# Altium schematic sheet bg_sensor.SchDoc
size A3
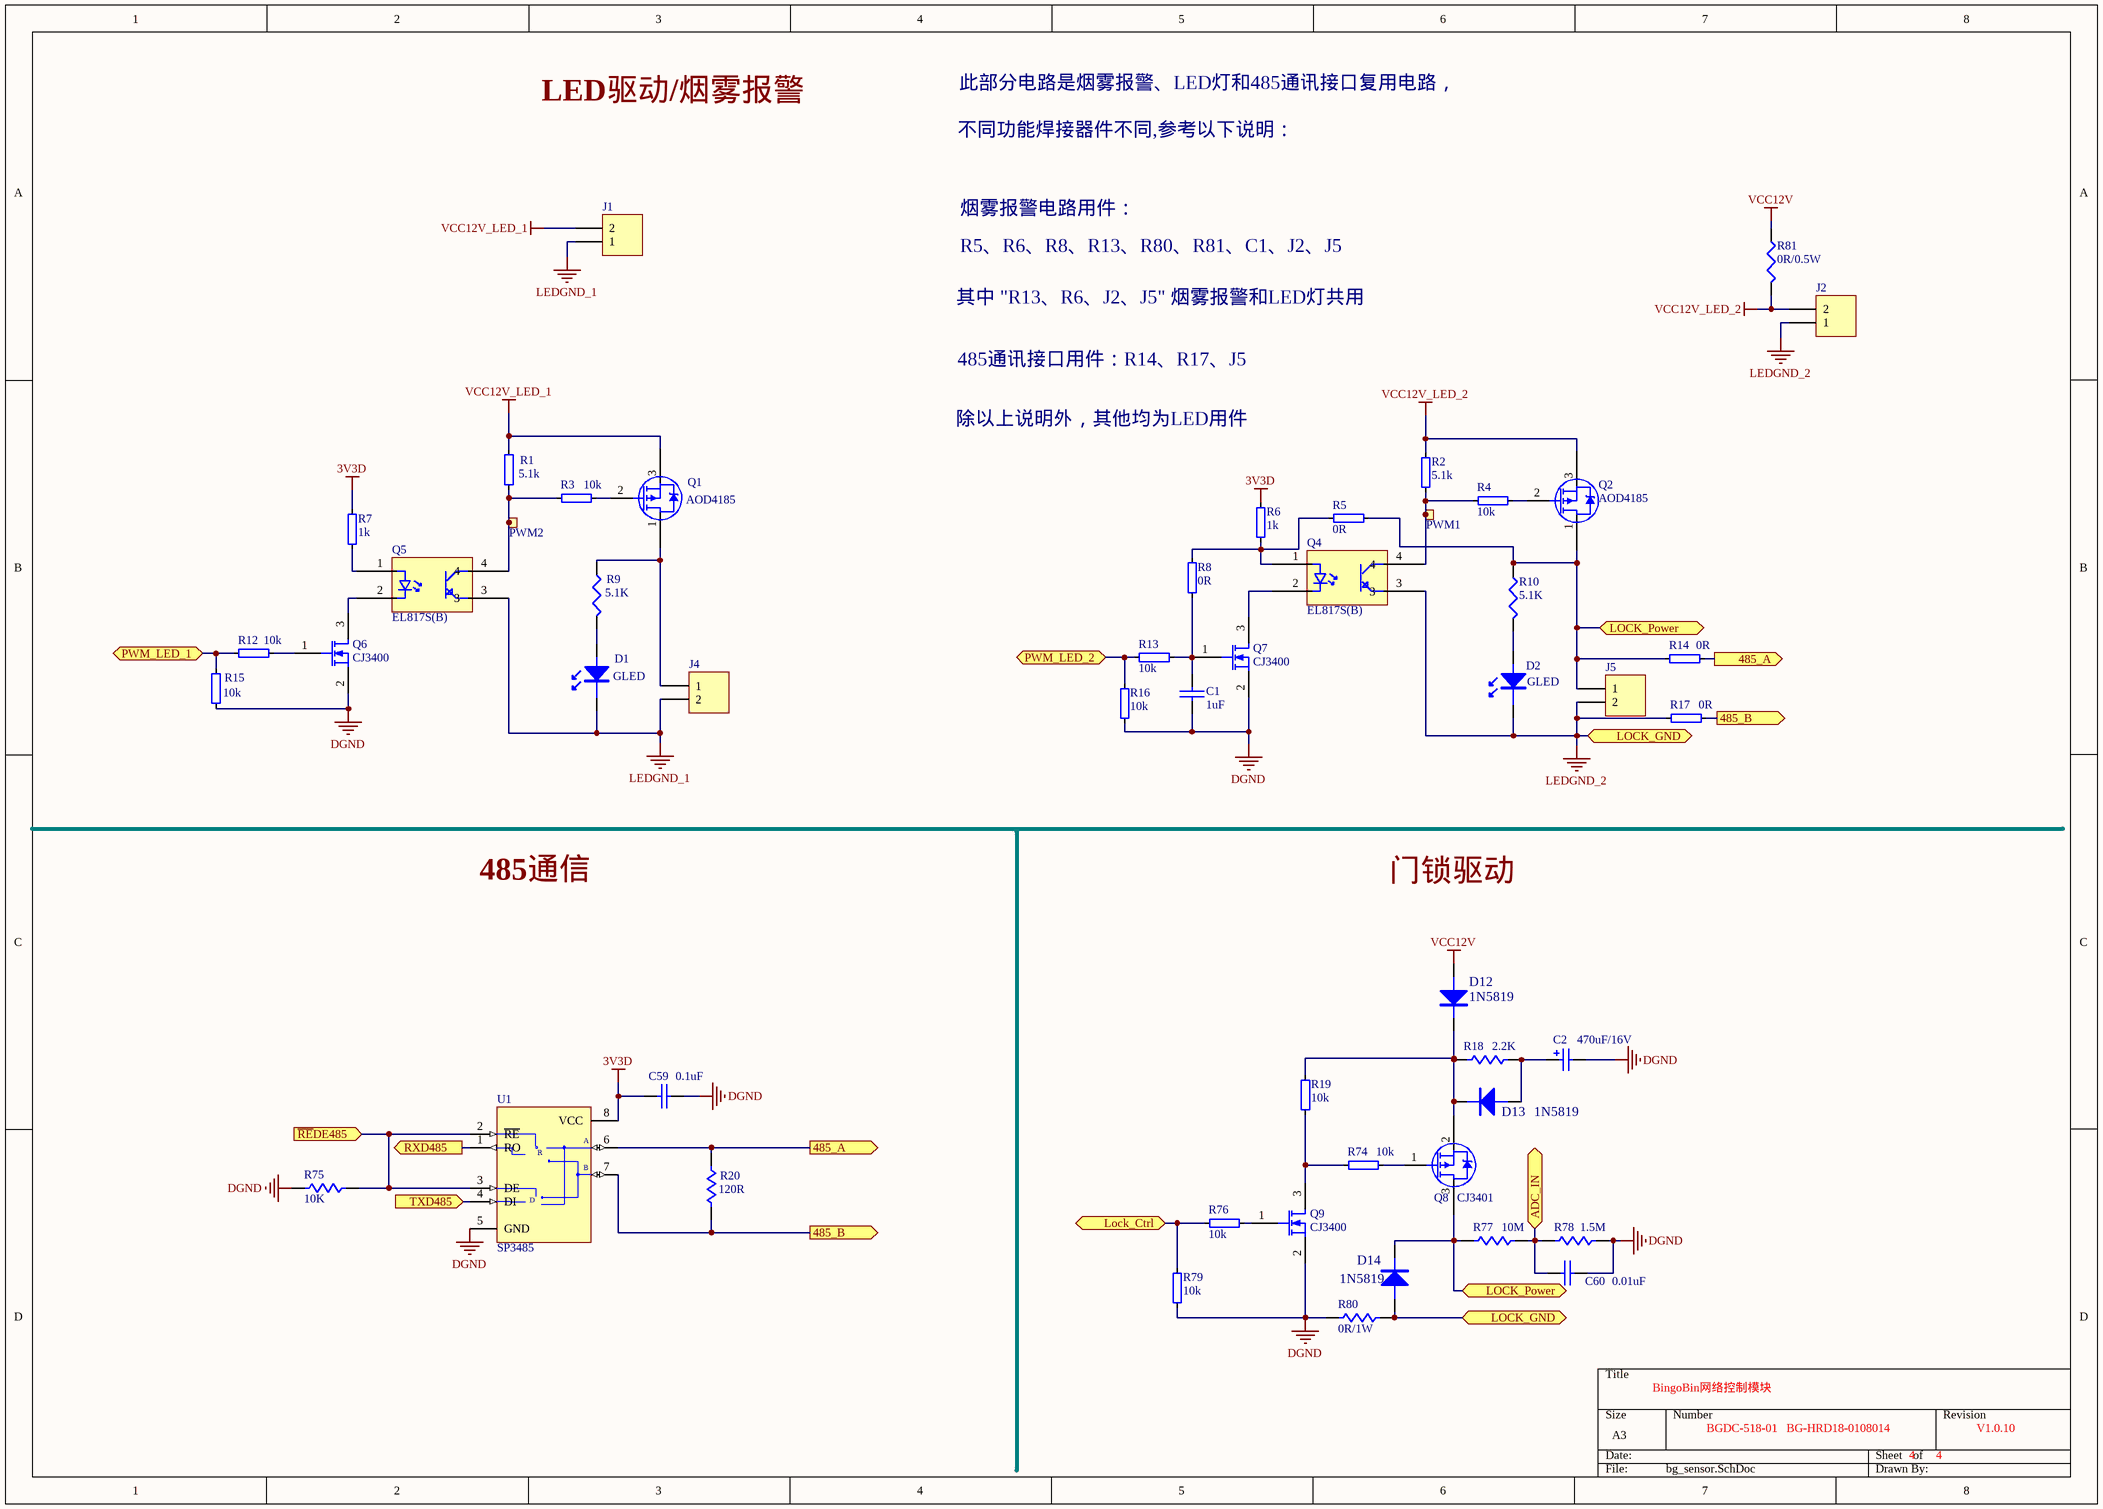
[diagram p0: bg_sensor.SchDoc]

## Parts
C1  1uF  [C0603]
C2  470uF/16V  [C10*10.5mm]
C59  0.1uF  [C0603]
C60  0.01uF  [C0603]
D1  GLED  [LED-0805]
D2  GLED  [LED-0805]
D12  1N5819  [SOD123]
D13  1N5819  [SOD123]
D14  1N5819  [SOD123]
J1  36-57VDC RTN  [MKDS_5_6.35]  (value not drawn)
J2  36-57VDC RTN  [MKDS_5_6.35]  (value not drawn)
J4  36-57VDC RTN  [MKDS_5_6.35]  (value not drawn)
J5  36-57VDC RTN  [MKDS_5_6.35]  (value not drawn)
PWM1  ?.0mm,SMD  [TP_SMD_1mm]  (value not drawn)  (no BOM)
PWM2  ?.0mm,SMD  [TP_SMD_1mm]  (value not drawn)  (no BOM)
Q1  AOD4185  [TO252]
Q2  AOD4185  [TO252]
Q4  EL817S(B)  [LC_SMD-4]
Q5  EL817S(B)  [LC_SMD-4]
Q6  CJ3400  [sot-23]
Q7  CJ3400  [sot-23]
Q8  CJ3401  [sot-23]
Q9  CJ3400  [sot-23]
R1  5.1k  [R0603]
R2  5.1k  [R0603]
R3  10k  [R0603]
R4  10k  [R0603]
R5  0R  [R0603]
R6  1k  [R0603]
R7  1k  [R0603]
R8  0R  [R0603]
R9  5.1K  [R0603]
R10  5.1K  [R0603]
R12  10k  [R0603]
R13  10k  [R0603]
R14  0R  [R0603]
R15  10k  [R0603]
R16  10k  [R0603]
R17  0R  [R0603]
R18  2.2K  [0805]
R19  10k  [R0603]
R20  120R  [R0603]
R74  10k  [R0603]
R75  10K  [R0603]
R76  10k  [R0603]
R77  10M  [R0603]
R78  1.5M  [R0603]
R79  10k  [R0603]
R80  0R/1W  [2512]
R81  0R/0.5W  [1206]
U1  SP3485  [SOIC8]

## Ports
485_A (out), 485_B (out), ADC_IN, Lock_Ctrl, LOCK_GND, LOCK_Power, PWM_LED_1, PWM_LED_2, RXD485 (out), TXD485 (in), ~{RE}DE485 (in)

## Nets
3V3D: C59.1 R6.2 R7.2 U1.8(VCC)
DGND: C1.1 C2.2 C59.2 C60.2 Q6.2(S) Q7.2(S) Q9.2(S) R15.1 R16.1 R75.2 R78.1 R79.1 R80.2 U1.5(GND)
LEDGND_1: D1.2 J1.1 J4.2 Q5.3
LEDGND_2: D2.2 D14.1(A) J2.1 J5.2 Q4.3 R17.1 R80.1 ; port LOCK_GND
VCC12V: D12.1(A) R81.1
VCC12V_LED_1: J1.2 Q1.3(S) R1.2
VCC12V_LED_2: J2.2 Q2.3(S) R2.2 R81.2
485_A: R14.2 R20.2 U1.6(A) ; port 485_A
485_B: R17.2 R20.1 U1.7(B) ; port 485_B
ADC_IN: C60.1 R77.1 R78.2 ; port ADC_IN
Lock_Ctrl: R76.1 R79.2 ; port Lock_Ctrl
LOCK_Power: D14.2(K) J5.1 Q2.1(D) Q8.3(D) R5.1 R10.1 R14.1 R77.2 ; port LOCK_Power
PWM_LED_1: R12.1 R15.2 ; port PWM_LED_1
PWM_LED_2: R13.1 R16.2 ; port PWM_LED_2
~{RE}DE485: R75.1 U1.2(~{RE}) U1.3(DE) ; port ~{RE}DE485
RXD485: U1.1(RO) ; port RXD485
TXD485: U1.4(DI) ; port TXD485
NetC1_2: C1.2 Q7.1(G) R8.2 R13.2
NetC2_1: C2.1 D13.1(A) R18.2
NetD1_1: D1.1 R9.2
NetD2_1: D2.1 R10.2
NetD12_2: D12.2(K) D13.2(K) Q8.2(S) R18.1 R19.2
NetJ4_1: J4.1 Q1.1(D) R9.1
NetPWM1_1: PWM1.1 Q4.4 R2.1 R4.1
NetPWM2_1: PWM2.1 Q5.4 R1.1 R3.1
NetQ1_2: Q1.2(G) R3.2
NetQ2_2: Q2.2(G) R4.2
NetQ4_1: Q4.1 R5.2 R6.1 R8.1
NetQ4_2: Q4.2 Q7.3(D)
NetQ5_1: Q5.1 R7.1
NetQ5_2: Q5.2 Q6.3(D)
NetQ6_1: Q6.1(G) R12.2
NetQ8_1: Q8.1(G) R74.2
NetQ9_1: Q9.1(G) R76.2
NetQ9_3: Q9.3(D) R19.1 R74.1

## Notes on the sheet
- LED驱动/烟雾报警
- 此部分电路是烟雾报警、LED灯和485通讯接口复用电路，
- 不同功能焊接器件不同,参考以下说明：
- 烟雾报警电路用件：
- 其中 "R13、R6、J2、J5" 烟雾报警和LED灯共用
- R5、R6、R8、R13、R80、R81、C1、J2、J5
- 485通讯接口用件：R14、R17、J5
- 除以上说明外，其他均为LED用件
- 485通信
- 门锁驱动
- BingoBin网络控制模块
- BGDC-518-01   BG-HRD18-0108014
- 4
- V1.0.10
- (in symbol SP3485) R; D

## Library data of the parts
C1 C59 C60 = C0603: Capacitor, Ceramic, 0.1uF, 16V, 10%, 0603, X7R
  C1: Value: 1uF
  C59: Value: 0.1uF
  C60: Value: 0.01uF
C2 = Cap Pol2: Capacitor, Aluminum Electrolytic, 470uF,16V, 20%; Published: 8-Jun-2000; LatestRevisionDate: 17-Jul-2002; LatestRevisionNote: Re-released for DXP Platform.; PackageReference: POLAR0.8; Publisher: Altium Limited; PackageDescription: Polarized Capacitor; 2 Leads; Value: 470uF/16V
D1 D2 = LED_0805: 翠绿色 贴片LED ( Iv=220-270mcd @IF=5mA)
D12-D14 = DIODE: Diode Schottky, 40V,1A
J1 J2 J4 J5 = Header 2: WJ15EDGVC-3.81-2P; LatestRevisionDate: 17-Jul-2002; LatestRevisionNote: Re-released for DXP Platform.; Publisher: Altium Limited
PWM1 PWM2 = TESTPAD: 1.0mm circular SMD testpad; Part Number: TP_SMD_?.0MM; Manufacturer: Nordic Semiconductor; Artikkelnr Noca: N.A.; Manufacturer Part Number: *; Datasheet: *; LatestRevisionDate: 2013-06-11; Pin Count: 1; Publisher: Nordic Semiconductor; Published: 2013-06-11; Value: ?.0mm,SMD; Note: *; Supplier: *; Supplier part number: *; 2nd source Supplier: *; 2nd source part number: *; Footprint Doc: TP_SMD_?.0mm; Artikkelnr Simpro: N.A.
Q1 Q2 = PMOS: AOD4185(TO-252-2)
Q4 Q5 = Optocoupler: EL817S(B)(TU)-F
Q6 Q7 Q9 = MOSFET-N: N沟道,30V,5.6A,27mΩ(Typ,@Vgs=4.5V); Published: 8-Jun-2000; LatestRevisionDate: 17-Jul-2002; LatestRevisionNote: Re-released for DXP Platform.; PackageVersion: 1995/1996; PackageReference: E3; Publisher: Altium Limited; PackageDescription: TO, Flat Index; 3 In-Line, Axial Leads; Body Dia. 4.6mm; Lead Dia. 0.5 mm (max)
Q8 = PMOS-2: CJ3401(SOT-23-3)
R1-R8 R12-R17 R19 R74 R76 R79 = R0402-12k: RES, THICK FILM, 10K, 5%, 1/10W, 0603; Part Number: R0402-10k; Note: Chip Res 1%; Artikkelnr Noca: 27049099; Manufacturer: *; Manufacturer Part Number: *; Datasheet: *; Footprint: 0402; LatestRevisionDate: 2009-11-23; Pin Count: 2; Publisher: Nordic Semiconductor; Published: 2009-05-08; Supplier: Farnell; Supplier part number: 173-8865; 2nd source Supplier: *; 2nd source part number: *
  R1 R2: Value: 5.1k
  R3 R4 R12 R13 R15 R16 R19 R74 R76 R79: Value: 10k
  R5 R8 R14 R17: Value: 0R
  R6 R7: Value: 1k
R9 R10 = Res3: RES, THICK FILM, 1K, 5%, 1/10W, 0603; Published: 8-Jun-2000; LatestRevisionDate: 29-May-2009; LatestRevisionNote: IPC-7351 Footprint Added.; PackageReference: J1-0603; Publisher: Altium Limited; PackageDescription: Chip Resistor; Value: 5.1K
R18 = R0603: RES, THICK FILM, 2.2K, 5%, 1/8W, 0805; Value: 2.2K
R20 = R0603: RES, THICK FILM, 120 OHM, 5%, 1/10W, 0603; Value: 120R
R75 = R0603: RES, THICK FILM, 10K, 5%, 1/10W, 0603; Value: 10K
R77 = R0603: RES, THICK FILM, 10M, 5%, 1/10W, 0603; Value: 10M
R78 R80 = R0603: RES, THICK FILM, 1.5M, 5%, 1/10W, 0603
  R78: Value: 1.5M
  R80: Value: 0R/1W
R81 = Res3: RES, THICK FILM, 0.39 OHM, 1%, 3/4W, 2010; Published: 8-Jun-2000; LatestRevisionDate: 29-May-2009; LatestRevisionNote: IPC-7351 Footprint Added.; PackageReference: J1-0603; Publisher: Altium Limited; PackageDescription: Chip Resistor; Value: 0R/0.5W
U1 = SP3485: +3.3V Low Power Half-Duplex RS-485 Transceiver with 10Mbps Data Rate